# Altium schematic sheet 原理图.SchDoc
size 381 x 241 mm
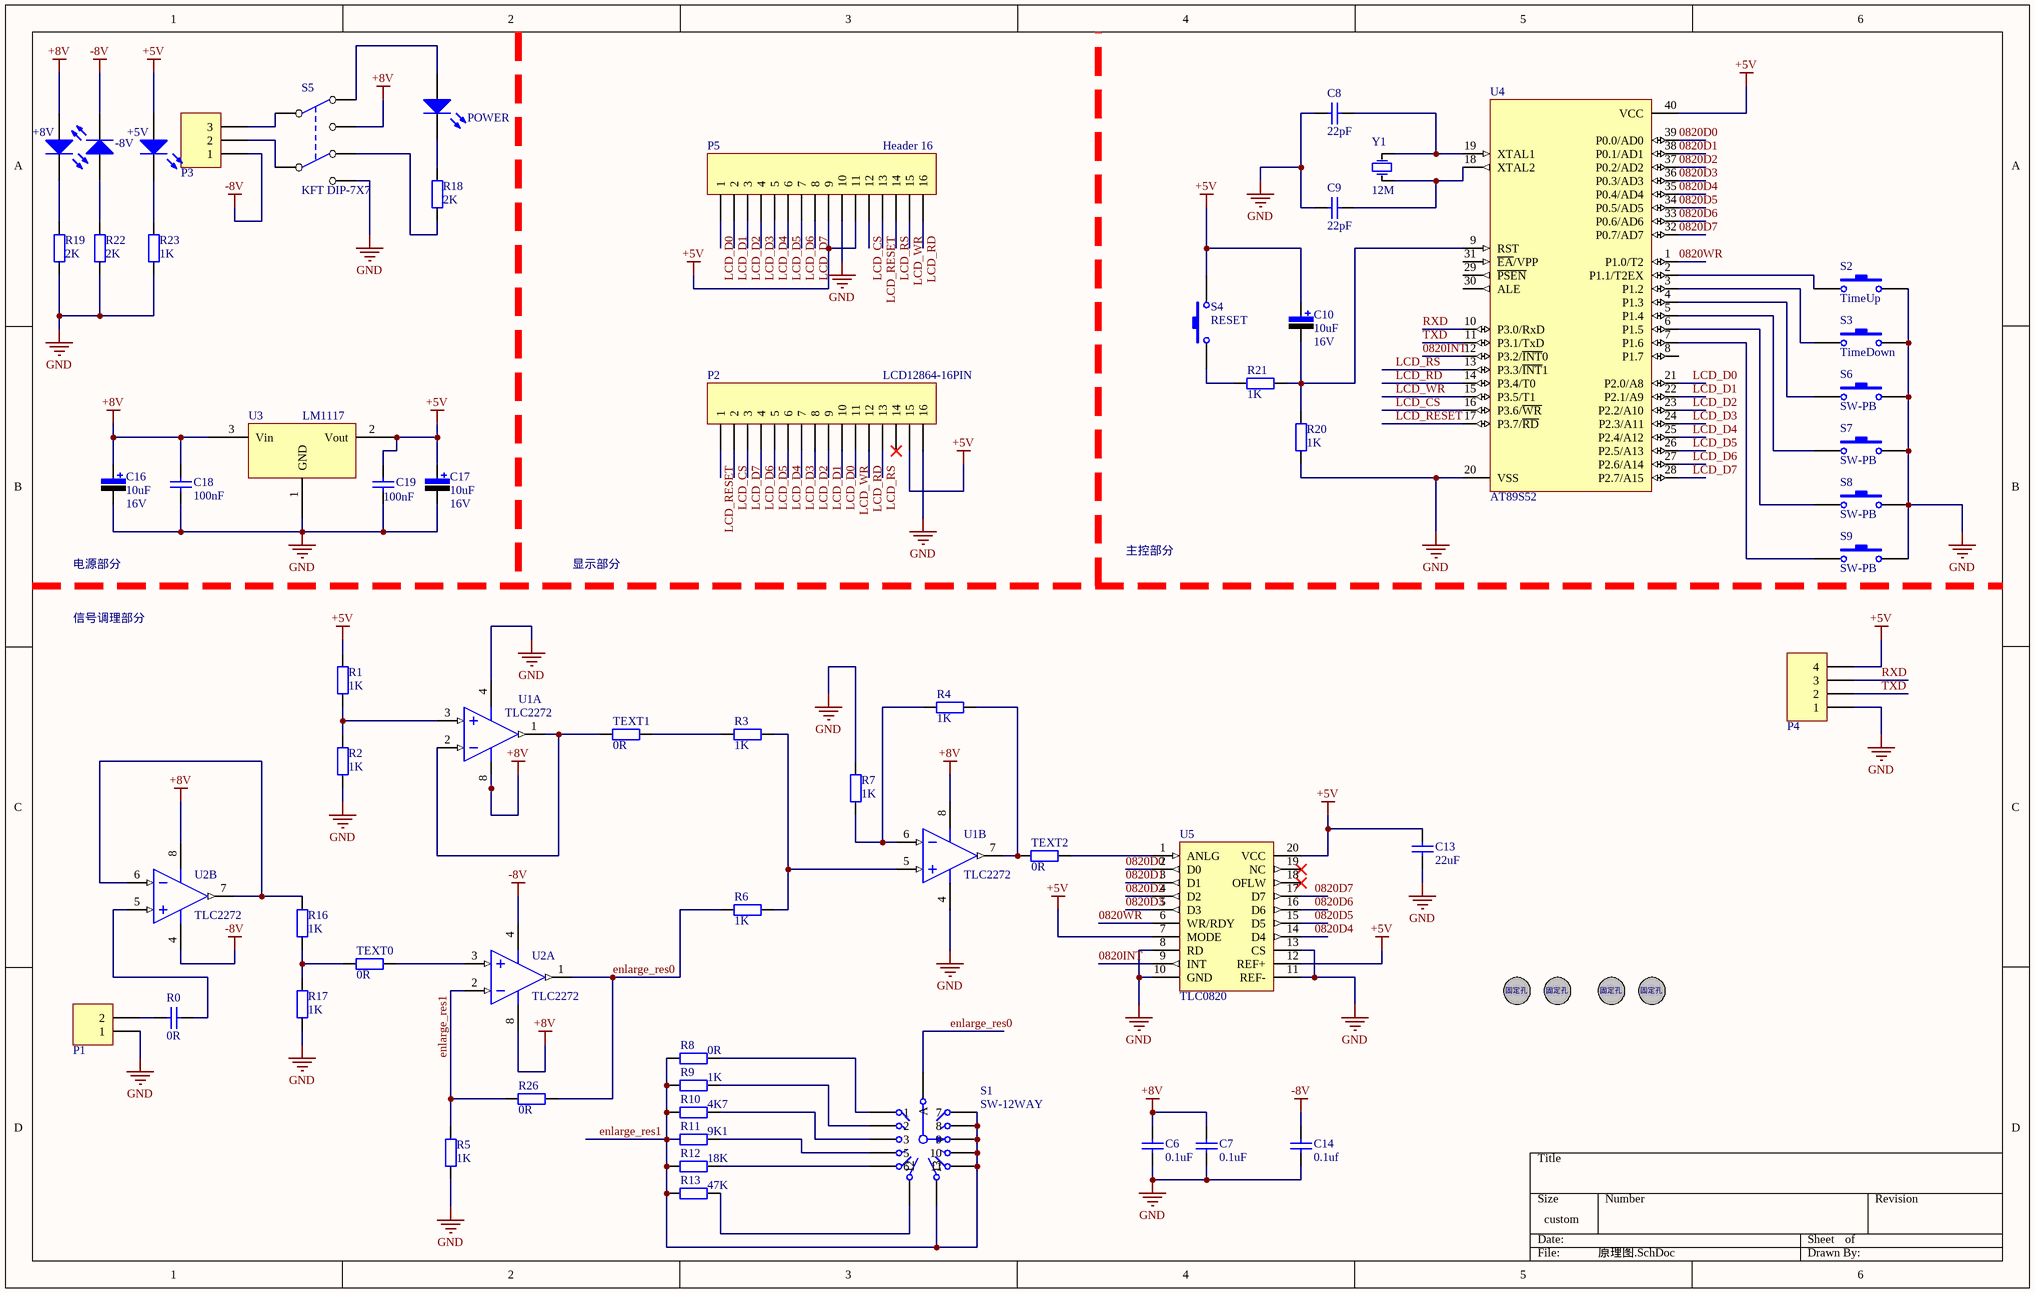
[diagram p0: 原理图.SchDoc]

## Parts
1  3mm固定孔  [3mm-hole]  (value not drawn)
2  3mm固定孔  [3mm-hole]  (value not drawn)
3  3mm固定孔  [3mm-hole]  (value not drawn)
4  3mm固定孔  [3mm-hole]  (value not drawn)
+5V  LED0  [LED_0805]  (value not drawn)
+8V  LED0  [LED_0805]  (value not drawn)
-8V  LED0  [LED_0805]  (value not drawn)
C6  value 0.1uF  [C-RAD-0603]  (hidden comment: Cap)
C7  value 0.1uF  [C-RAD-0603]  (hidden comment: Cap)
C8  value 22pF  [C-RAD-0603]  (hidden comment: Cap)
C9  value 22pF  [C-RAD-0603]  (hidden comment: Cap)
C10  value 10uF  Vol: 16V  [CAP-3528]  (hidden comment: Cap Pol)
C13  value 22uF  [C-RAD-0603]  (hidden comment: Cap)
C14  value 0.1uf  [C-RAD-0603]  (hidden comment: Cap)
C16  value 10uF  Vol: 16V  [CAP-3528]  (hidden comment: Cap Pol)
C17  value 10uF  Vol: 16V  [CAP-3528]  (hidden comment: Cap Pol)
C18  value 100nF  [C-RAD-0603]  (hidden comment: Cap)
C19  value 100nF  [C-RAD-0603]  (hidden comment: Cap)
P1  Header 2  [HDR2X1_B2]  (value not drawn)
P2  LCD12864-16PIN  [HDR16X1_A]
P3  Header 3  [HDR3X1_B1]  (value not drawn)
P4  Header 4  [HDR4X1_A]  (value not drawn)
P5  Header 16  [HDR16X1_A]
POWER  LED0  [LED_0805]  (value not drawn)
R0  value 0R  [C-RAD-0603]  (hidden comment: Cap)
R1  value 1K  [0603-1]  (hidden comment: Res1)
R2  value 1K  [0603-1]  (hidden comment: Res1)
R3  value 1K  [0603-1]  (hidden comment: Res1)
R4  value 1K  [0603-1]  (hidden comment: Res1)
R5  value 1K  [0603-1]  (hidden comment: Res1)
R6  value 1K  [0603-1]  (hidden comment: Res1)
R7  value 1K  [0603-1]  (hidden comment: Res1)
R8  value 0R  [0603-1]  (hidden comment: Res1)
R9  value 1K  [0603-1]  (hidden comment: Res1)
R10  value 4K7  [0603-1]  (hidden comment: Res1)
R11  value 9K1  [0603-1]  (hidden comment: Res1)
R12  value 18K  [0603-1]  (hidden comment: Res1)
R13  value 47K  [0603-1]  (hidden comment: Res1)
R16  value 1K  [0603-1]  (hidden comment: Res1)
R17  value 1K  [0603-1]  (hidden comment: Res1)
R18  value 2K  [0603-1]  (hidden comment: Res1)
R19  value 2K  [0603-1]  (hidden comment: Res1)
R20  value 1K  [0603-1]  (hidden comment: Res1)
R21  value 1K  [0603-1]  (hidden comment: Res1)
R22  value 2K  [0603-1]  (hidden comment: Res1)
R23  value 1K  [0603-1]  (hidden comment: Res1)
R26  value 0R  [0603-1]  (hidden comment: Res1)
S1  SW-12WAY  [SW-12WAY]
S2  TimeUp  [SMD-6X6X6]
S3  TimeDown  [SMD-6X6X6]
S4  RESET  [SMD-6X6X6]
S5  KFT DIP-7X7  [KFT DIP-7X7]
S6  SW-PB  [SMD-6X6X6]
S7  SW-PB  [SMD-6X6X6]
S8  SW-PB  [SMD-6X6X6]
S9  SW-PB  [SMD-6X6X6]
TEXT0  value 0R  [0603-1]  (hidden comment: Res1)
TEXT1  value 0R  [0603-1]  (hidden comment: Res1)
TEXT2  value 0R  [0603-1]  (hidden comment: Res1)
U1  TLC2272  [SOP8]  (parts A,B of 2)
U2  TLC2272  [SOP8]  (parts A,B of 2)
U3  LM1117  [LM1117]
U4  AT89S52  [DIP-40]
U5  TLC0820  [SO20_M]
Y1  value 12M  [OSC UM-5]  (hidden comment: XTAL)

## Nets
+5V: +5V.1(A) C10.1 C13.2 C17.1 C19.2 P2.15 P4.4 P5.9 P5.11 R1.2 S4.2 U3.2(Vout) U4.40(VCC) U5.7(MODE) U5.12(REF+) U5.20(VCC)
+8V: +8V.1(A) C6.2 C7.2 C16.1 C18.2 S5.1 U1.8(VDD) U2.8(VDD) U3.3(Vin)
-8V: -8V.2(K) C14.2 P3.1 U2.4(GND)
GND: C6.1 C7.1 C8.1 C9.1 C13.1 C14.1 C16.2 C17.2 C18.1 C19.1 P1.1 P2.16 P4.1 P5.10 R2.1 R5.1 R7.2 R17.2 R19.1 R20.1 R22.1 R23.1 S2.2 S3.2 S5.6 S6.2 S7.2 S8.2 S9.2 U1.4(GND) U3.1(GND) U4.20(VSS) U5.8(RD) U5.10(GND) U5.11(REF-) U5.13(CS)
0820D0: U4.39(P0.0/AD0) U5.2(D0)
0820D1: U4.38(P0.1/AD1) U5.3(D1)
0820D2: U4.37(P0.2/AD2) U5.4(D2)
0820D3: U4.36(P0.3/AD3) U5.5(D3)
0820D4: U4.35(P0.4/AD4) U5.14(D4)
0820D5: U4.34(P0.5/AD5) U5.15(D5)
0820D6: U4.33(P0.6/AD6) U5.16(D6)
0820D7: U4.32(P0.7/AD7) U5.17(D7)
0820INT: U4.12(P3.2/~{INT}0) U5.9(INT)
0820WR: U4.1(P1.0/T2) U5.6(WR/RDY)
enlarge_res0: R6.1 R26.2 S1.A U2.1(OUT)
enlarge_res1: R5.2 R8.1 R9.1 R10.1 R11.1 R12.1 R13.1 R26.1 S1.7 S1.8 S1.9 S1.10 S1.11 S1.13 U2.2(IN-)
LCD_CS: P2.2 P5.12 U4.16(P3.6/~{WR})
LCD_D0: P2.10 P5.1 U4.21(P2.0/A8)
LCD_D1: P2.9 P5.2 U4.22(P2.1/A9)
LCD_D2: P2.8 P5.3 U4.23(P2.2/A10)
LCD_D3: P2.7 P5.4 U4.24(P2.3/A11)
LCD_D4: P2.6 P5.5 U4.25(P2.4/A12)
LCD_D5: P2.5 P5.6 U4.26(P2.5/A13)
LCD_D6: P2.4 P5.7 U4.27(P2.6/A14)
LCD_D7: P2.3 P5.8 U4.28(P2.7/A15)
LCD_RD: P2.12 P5.16 U4.14(P3.4/T0)
LCD_RESET: P2.1 P5.13 U4.17(P3.7/~{RD})
LCD_RS: P2.13 P5.14 U4.13(P3.3/~{INT}1)
LCD_WR: P2.11 P5.15 U4.15(P3.5/T1)
RXD: P4.3 U4.10(P3.0/RxD)
TXD: P4.2 U4.11(P3.1/TxD)
Net+5V_2: +5V.2(K) R23.2
Net+8V_2: +8V.2(K) R19.2
Net-8V_1: -8V.1(A) R22.2
NetC8_2: C8.2 U4.19(XTAL1) Y1.2(OSC2)
NetC9_2: C9.2 U4.18(XTAL2) Y1.1(OSC1)
NetC10_2: C10.2 R20.2 R21.2 U4.9(RST)
NetP1_2: P1.2 R0.1
NetP3_2: P3.2 S5.5
NetP3_3: P3.3 S5.2
NetPOWER_1: POWER.1(A) S5.3
NetPOWER_2: POWER.2(K) R18.2
NetR0_2: R0.2 U2.5(IN+)
NetR1_1: R1.1 R2.2 U1.3(IN+)
NetR3_1: R3.1 TEXT1.2
NetR3_2: R3.2 R6.2 U1.5(IN+)
NetR4_1: R4.1 TEXT2.1 U1.7(OUT)
NetR4_2: R4.2 R7.1 U1.6(IN-)
NetR8_2: R8.2 S1.1
NetR9_2: R9.2 S1.2
NetR10_2: R10.2 S1.3
NetR11_2: R11.2 S1.5
NetR12_2: R12.2 S1.6
NetR13_2: R13.2 S1.12
NetR16_1: R16.1 R17.1 TEXT0.1
NetR16_2: R16.2 U2.6(IN-) U2.7(OUT)
NetR18_1: R18.1 S5.4
NetR21_1: R21.1 S4.1
NetS2_1: S2.1 U4.2(P1.1/T2EX)
NetS3_1: S3.1 U4.3(P1.2)
NetS6_1: S6.1 U4.4(P1.3)
NetS7_1: S7.1 U4.5(P1.4)
NetS8_1: S8.1 U4.6(P1.5)
NetS9_1: S9.1 U4.7(P1.6)
NetTEXT0_2: TEXT0.2 U2.3(IN+)
NetTEXT1_1: TEXT1.1 U1.1(OUT) U1.2(IN-)
NetTEXT2_2: TEXT2.2 U5.1(ANLG)

Not connected (* = marked no-connect by the designer): P2 14*; U4 8(P1.7) 29(~{PSEN}) 30(ALE) 31(~{EA}/VPP); U5 18(OFLW)* 19(NC)*

## Notes on the sheet
- 电源部分
- 显示部分
- 主控部分
- 信号调理部分
- (in symbol 3mm固定孔) 固定孔

## Library data of the parts
+5V +8V -8V POWER = LED0: 发光二极管; Published: 8-Jun-2000; LatestRevisionDate: 08-Jul-2005; LatestRevisionNote: Mech Layer 1 removed.; PackageReference: LED-0; Publisher: Altium Limited
C6-C9 C13 C14 C18 C19 R0 = Cap: 无极性电容; Published: 8-Jun-2000; LatestRevisionDate: 17-Jul-2002; LatestRevisionNote: Re-released for DXP Platform.; PackageReference: RAD-0.3; Publisher: Altium Limited
C10 C16 C17 = Cap Pol: 极性电解电容; Published: 8-Jun-2000; LatestRevisionDate: 17-Jul-2002; LatestRevisionNote: Re-released for DXP Platform.; PackageReference: RB7.6-15; Publisher: Altium Limited
P1 = Header 2: 接插件; LatestRevisionDate: 17-Jul-2002; LatestRevisionNote: Re-released for DXP Platform.; Publisher: Altium Limited
P2 P5 = Header 16: Header16贴片; LatestRevisionDate: 17-Jul-2002; LatestRevisionNote: Re-released for DXP Platform.; Publisher: Altium Limited
P3 = Header 3: 接插件; LatestRevisionDate: 17-Jul-2002; LatestRevisionNote: Re-released for DXP Platform.; Publisher: Altium Limited
P4 = Header 4: 接插件; LatestRevisionDate: 17-Jul-2002; LatestRevisionNote: Re-released for DXP Platform.; Publisher: Altium Limited
R1-R13 R16-R23 R26 TEXT0-TEXT2 = Res1: 贴片电阻; Published: 8-Jun-2000; LatestRevisionDate: 17-Jul-2002; LatestRevisionNote: Re-released for DXP Platform.; PackageReference: AXIAL-0.4; Publisher: Altium Limited
S1 = SW-12WAY: 12 Way Switch; Published: 24-Mar-1999; LatestRevisionDate: 17-Jul-2002; LatestRevisionNote: Re-released for DXP Platform.; PackageReference: DIP-13(14); Publisher: Altium Limited
S2-S4 S6-S9 = SW-PB: Switch; Published: 24-Mar-1999; LatestRevisionDate: 17-Jul-2002; LatestRevisionNote: Re-released for DXP Platform.; PackageReference: SPST-2; Publisher: Altium Limited
U1 U2 = TLC27L2AIDR: LinCMOS Precision Dual Operational Amplifier; Published: 15-Apr-2002; LatestRevisionDate: 13-Apr-2006; LatestRevisionNote: IPC-7351 Footprint Added.; DatasheetVersion: Aug-1988; PackageVersion: Jan-1998; PackageReference: D008; Publisher: Altium Limited; PackageDescription: 8-Pin Small Outline Integrated Circuit 1.27 mm Pitch; Code_IPC: SOIC127P600-8; ComponentLink1Description: Manufacturer Link; ComponentLink1URL: http://www.ti.com/; ComponentLink2Description: Datasheet; ComponentLink2URL: http://www-s.ti.com/sc/ds/tlc27l2a.pdf
U3 = LM1117: 3端线性稳压器
U4 = AT89S52: 51系列单片机; Published: 21-May-2003; DatasheetVersion: 5-Jun-2002; PackageVersion: Aug-2000; PackageReference: SOT129-1; Publisher: Altium Limited; PackageDescription: DIP, Plastic; 40 Leads; Row Spacing 15.24 mm; Pitch 2.54 mm; Code_JEDEC: MO-015; ComponentLink1Description: Manufacturer Link; ComponentLink1URL: http://www-us2.semiconductors.philips.com/; ComponentLink2Description: Datasheet; ComponentLink2URL: http://www.semiconductors.philips.com/acrobat/datasheets/P89C5XX2_2.pdf
Y1 = XTAL: 晶振; Published: 8-Jun-2000; LatestRevisionDate: 17-Jul-2002; LatestRevisionNote: Re-released for DXP Platform.; PackageReference: R38; Publisher: Altium Limited